# Altium schematic sheet mpu6500.SchDoc
size A
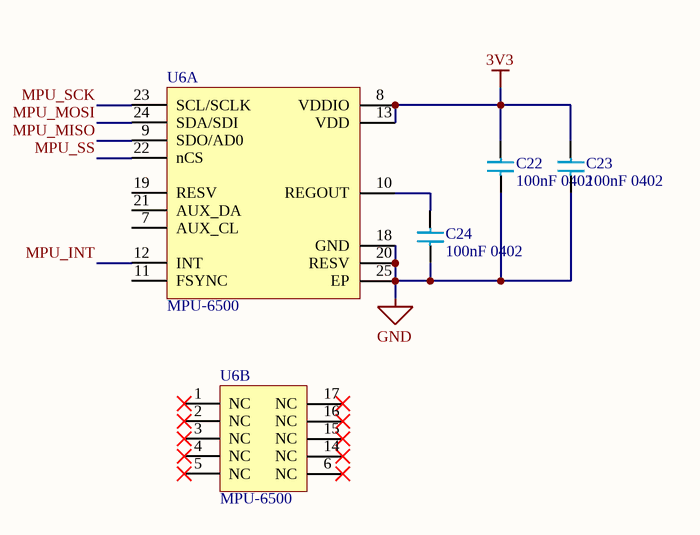
[diagram p0: mpu6500.SchDoc]

## Parts
C22  100nF 0402  [C0402]
C23  100nF 0402  [C0402]
C24  100nF 0402  [C0402]
U6  MPU-6500  [QFN24]  (parts A,B of 2)

## Nets
3V3: C22.1 C23.1 U6.8(VDDIO) U6.13(VDD)
GND: C22.2 C23.2 C24.2 U6.18(GND) U6.20(RESV) U6.25(EP)
MPU_INT: U6.12(INT)
MPU_MISO: U6.9(SDO/AD0)
MPU_MOSI: U6.24(SDA/SDI)
MPU_SCK: U6.23(SCL/SCLK)
MPU_SS: U6.22(nCS)
NetC24_1: C24.1 U6.10(REGOUT)

Not connected (* = marked no-connect by the designer): U6 1(NC)* 2(NC)* 3(NC)* 4(NC)* 5(NC)* 6(NC)* 7(AUX_CL) 11(FSYNC) 14(NC)* 15(NC)* 16(NC)* 17(NC)* 19(RESV) 21(AUX_DA)

## Library data of the parts
C22-C24 = C0402-100nF
U6 = MPU-6500: GYRO/ACCELEROMETER 6AXIS 24QFN; Manufacturer: TDK InvenSense; Sensor Type: Accelerometer,Gyroscope; Output Type: Digital; Operating Supply Voltage: 3.45V; Supplier 1: Digi-Key; Supplier Part Number 1: 1428-1011-1-ND; Manufacturer Part Number: MPU-6500; Stock 1: 29119; Pricing 1: 1=8.31, 5=7.288, 10=6.559, 25=5.83, 50=5.3928, 100=4.664, 500=4.3725, 1000=4.081 (USD); Mount: Surface Mount; Case/Package: QFN; Number of Pins: 24; Min Operating Temperature: -40°C; Max Operating Temperature: 85°C; Package Quantity: 5000; ComponentLink1URL: http://store.invensense.com/Datasheets/invensense/RM-MPU-6500A-00.pdf; ComponentLink1Description: http://store.invensense.com/Datasheets/invensense/RM-MPU-6500A-00.pdf